# EAGLE design mes-5 (EAGLE 9.5.2)
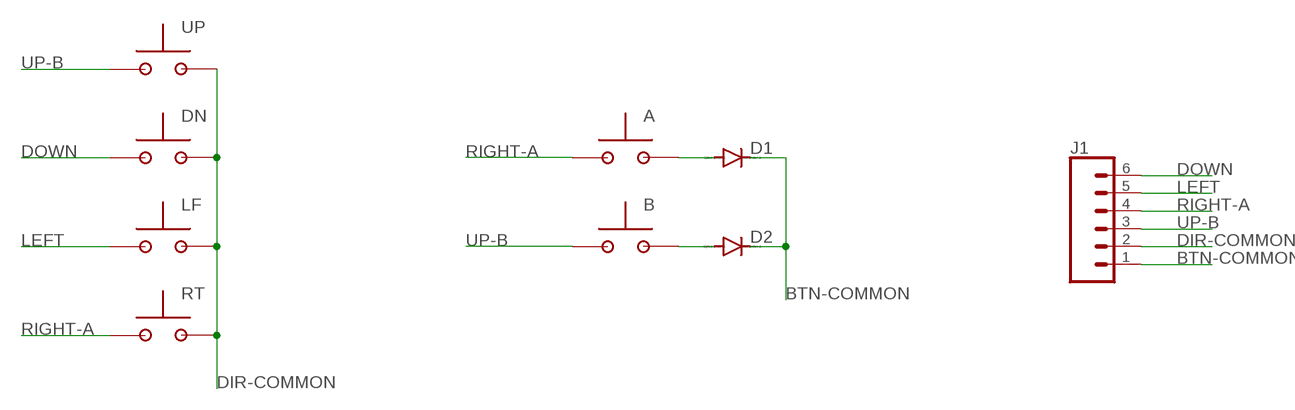
[diagram p0: schematic, sheet 1]

## Parts
A  RUBBERBUTTON_CONTACTAREA_9MM  [RUBBERBUTTON_CONTACTAREA_9MM]
B  RUBBERBUTTON_CONTACTAREA_9MM  [RUBBERBUTTON_CONTACTAREA_9MM]
D1  1N4148DO35-7  [DO35-7]
D2  1N4148DO35-7  [DO35-7]
DN  RUBBERBUTTON_CONTACTAREA_9MM  [RUBBERBUTTON_CONTACTAREA_9MM]
J1  CONN_06LONGPADS  [1X06_LONGPADS]
LF  RUBBERBUTTON_CONTACTAREA_9MM  [RUBBERBUTTON_CONTACTAREA_9MM]
RT  RUBBERBUTTON_CONTACTAREA_9MM  [RUBBERBUTTON_CONTACTAREA_9MM]
UP  RUBBERBUTTON_CONTACTAREA_9MM  [RUBBERBUTTON_CONTACTAREA_9MM]

## Nets
BTN-COMMON: D1.C D2.C J1.1
DIR-COMMON: DN.B J1.2 LF.B RT.B UP.B
DOWN: DN.A J1.6
LEFT: J1.5 LF.A
N$1: A.B D1.A
N$2: B.B D2.A
RIGHT-A: A.A J1.4 RT.A
UP-B: B.A J1.3 UP.A

## Library data of the parts
A B DN LF RT UP = Thomas:RUBBERBUTTON_CONTACTAREA_9MM
D1 D2 = diode:1N4148: DIODE high speed (Philips)
J1 = SparkFun-Connectors:CONN_06: Multi connection point. Often used as Generic Header-pin footprint for 0.1 inch spaced/style header connections On any of the 0.1 inch spaced packages, you can populate with these: Break Away Headers - Straight <https://www.sparkfun.com/products/116> (PRT-00116) Break Away Male Headers - Right Angle <https://www.sparkfun.com/products/553> (PRT-00553) Female Headers <https://www.sparkfun.com/products/115> (PRT-00115) Break Away Headers - Machine Pin <https://www.sparkfun.com/products/117> (PRT-00117) Break Away Female Headers - Swiss Machine Pin <https://www.sparkfun.com/products/743> (PRT-00743) Arduino Stackable Header - 6 Pin <https://www.sparkfun.com/products/9280> (PRT-09280) For SCREWTERMINALS and SPRING TERMINALS visit here: Screw Terimnals on SparkFun.com <https://www.sparkfun.com/search/results?term=Screw+Terminals> (5mm/3.5mm/2.54mm spacing) This device is also useful as a general connection point to wire up your design to another part of your project. Our various solder wires solder well into these plated through hole pads. Hook-Up Wire - Assortment (Stranded, 22 AWG) <https://www.sparkfun.com/products/11375> (PRT-11375) Hook-Up Wire - Assortment (Solid Core, 22 AWG) <https://www.sparkfun.com/products/11367> (PRT-11367) View the entire wire category on our website here <https://www.sparkfun.com/categories/141>

## Board
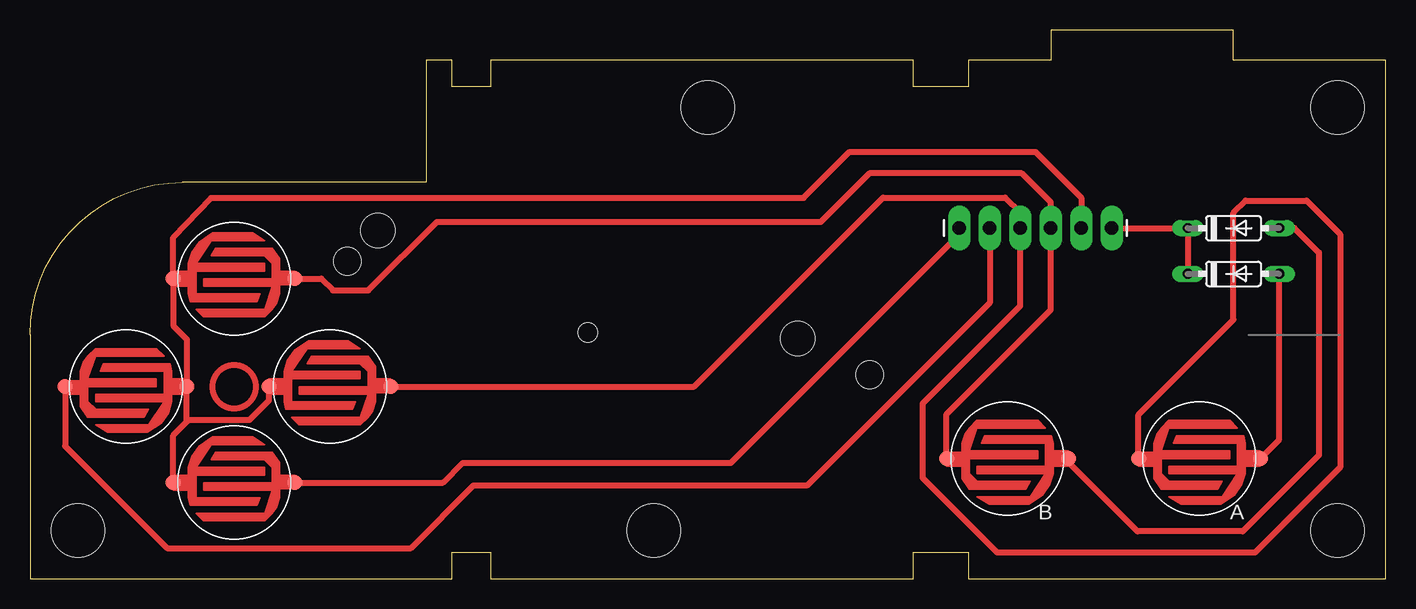
[diagram p1: board, top side]
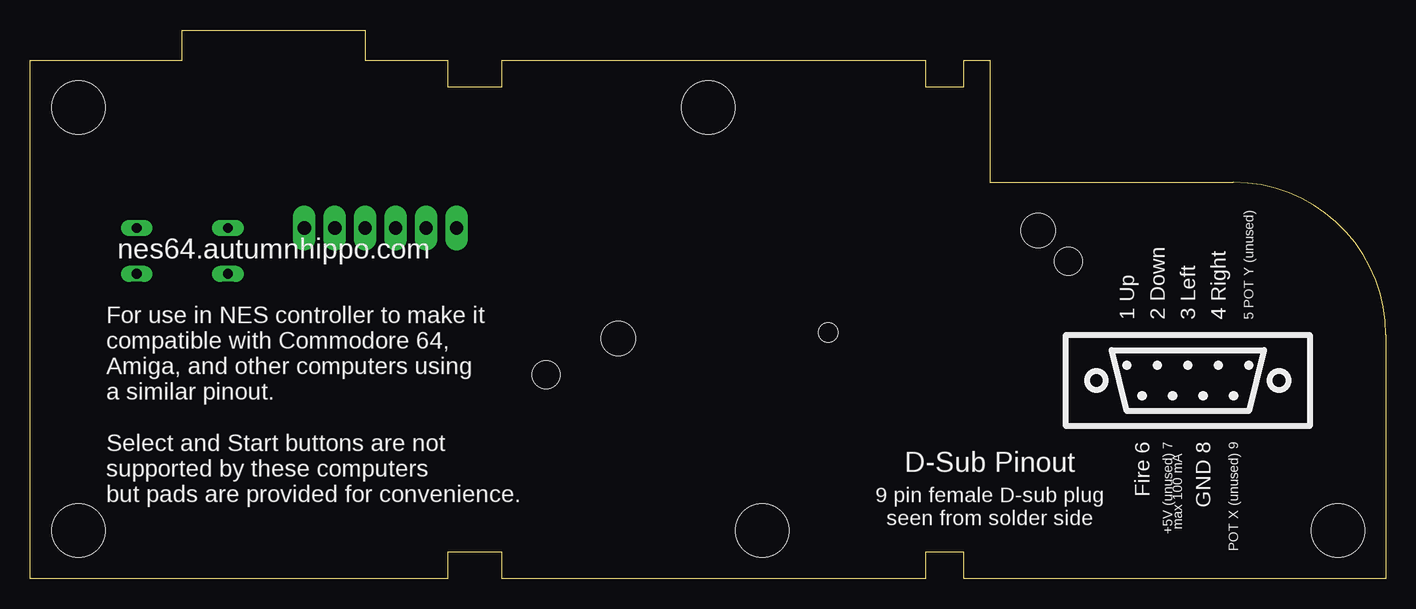
[diagram p2: board, bottom side, seen from below]

Size 113.03 x 45.72 mm. Coordinates in mm from the lower left corner, seen from the top.
Outline: 0,0 35.18,0 35.18,2.18 38.41,2.18 38.41,0 73.66,0 73.66,2.18 78.23,2.18 78.23,0 113.03,0 113.03,43.18 100.33,43.18 100.33,45.72 85.09,45.72 85.09,43.18 78.23,43.18 78.23,41 73.66,41 73.66,43.18 38.41,43.18 38.41,41 35.18,41 35.18,43.18 33.02,43.18 33.02,33.02 12.7,33.02 arc90 0,20.32 0,0
Copper layers (1*16): Top 0.035mm / dielectric 1.5mm / Bottom 0.035mm
Design rules "default": minimum track width 6mil, minimum drill 0.35mm, track to track 6mil, track to pad 6mil, pad to pad 6mil, via to via 6mil, smd to smd 6mil, copper to edge 40mil, drill to drill 6mil, minimum pad ring 10mil, minimum via ring 8mil, stop-mask expansion 4mil, vias tented up to drill 0mil, thermal gap 10mil
Holes 4.44 mm at 4,4 52,4 109,4 109,39.25 56.5,39.25
Holes 2.85 mm at 29,29 64,20
Holes 2.3 mm at 70,16.99 26.46,26.46
Holes 1.6 mm at 46.5,20.5

### Footprints (pad centres in the part's own frame; a part is rotated, then mirrored left to right if it is on the bottom)
RUBBERBUTTON_CONTACTAREA_9MM = smd 1.27 x 1.27: A -5.08,0; B 5.08,0
DO35-7 = drill 0.813 long: A 3.81,0; C -3.81,0
1X06_LONGPADS = drill 1.118 pad 1.88 long: 1 0,0; 2 2.54,0; 3 5.08,0; 4 7.62,0; 5 10.16,0; 6 12.7,0

### Placement (x,y rotation side)
A  97.49,10.01 0 top
B  81.48,10.01 0 top
D1  100.33,25.4 0 top
D2  100.33,29.21 0 top
DN  17.02,8 180 top
J1  90.17,29.21 180 top
LF  8,16 0 top
RT  24.99,16 180 top
UP  17.02,24.99 180 top

### Tracks (layer width: path | path; a pad name or v marks a point on that pad's centre or on a via)
BTN-COMMON
  Top 0.508: J1.1 D2.C D1.C
DIR-COMMON
  Top 0.508: DN.B 11.94,11.94 13.08,13.08 13.08,13.21 | 13.08,13.21 LF.B 13.08,19.94 11.94,21.08 UP.B 11.94,28.45 15.09,31.73 64.49,31.73 68.33,35.56 83.82,35.56 87.63,31.75 J1.2 | RT.B 19.91,14.83 18.29,13.21 13.08,13.21
DOWN
  Top 0.508: DN.A 34.42,8 36.07,9.65 58.42,9.65 77.47,28.7 J1.6
LEFT
  Top 0.508: LF.A 2.92,11.05 11.43,2.54 31.75,2.54 36.96,7.75 64.77,7.75 80.01,22.99 J1.5
N$1
  Top 0.508: A.B 104.14,11.58 D1.A
N$2
  Top 0.508: D2.A 105.41,29.21 107.44,27.18 107.44,10.29 101.09,3.94 92.33,3.94 86.56,9.7 B.B
RIGHT-A
  Top 0.508: A.A 92.41,13.66 100.33,21.59 100.33,30.48 101.35,31.5 106.43,31.5 109.22,28.7 109.22,9.27 102.11,2.16 80.64,2.16 74.42,8.38 74.42,14.61 82.55,22.73 J1.4 82.55,30.48 81.28,31.75 71.12,31.75 55.37,16 RT.A
UP-B
  Top 0.508: UP.A 24.29,24.99 25.27,24.02 28.19,24.02 33.9,29.72 65.91,29.72 69.98,33.78 82.68,33.78 85.09,31.37 J1.3 85.09,22.4 76.4,13.72 B.A
(copper drawn outside any net)
  shapes: Top circle x1

### Text on the board
bPlace: nes64.autumnhippo.com | 5 POT Y (unused) | 4 Right | 3 Left | 2 Down | 1 Up | POT X (unused) 9 | GND 8 | +5V (unused) 7 | max 100 mA | Fire 6 | D-Sub Pinout | 9 pin female D-sub plug / seen from solder side | For use in NES controller to make it / compatible with Commodore 64, / Amiga, and other computers using / a similar pinout. / / Select and Start buttons are not / supported by these computers / but pads are provided for convenience.
tDocu: Board thickness: 1.6 mm